# Altium project Motorsports Coaster.PrjPcb
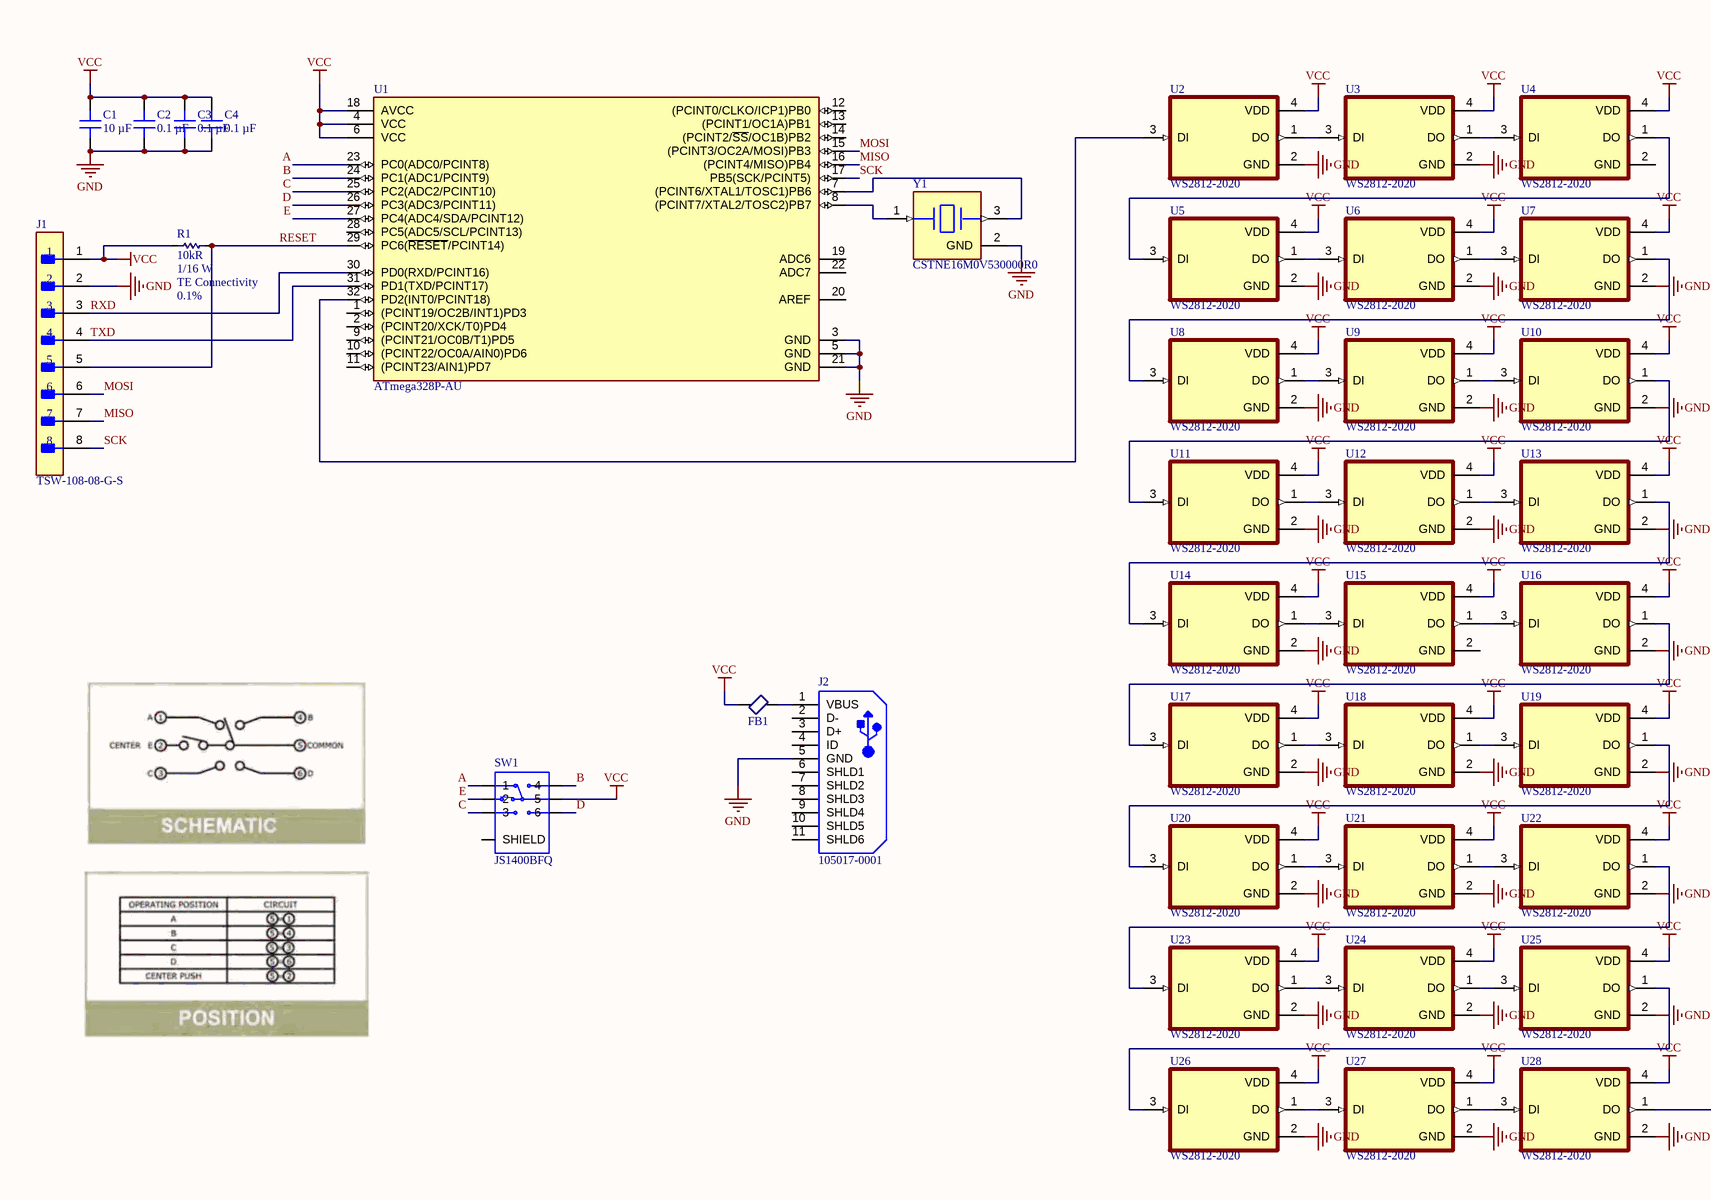
[diagram p0: Sheet4.SchDoc, left]
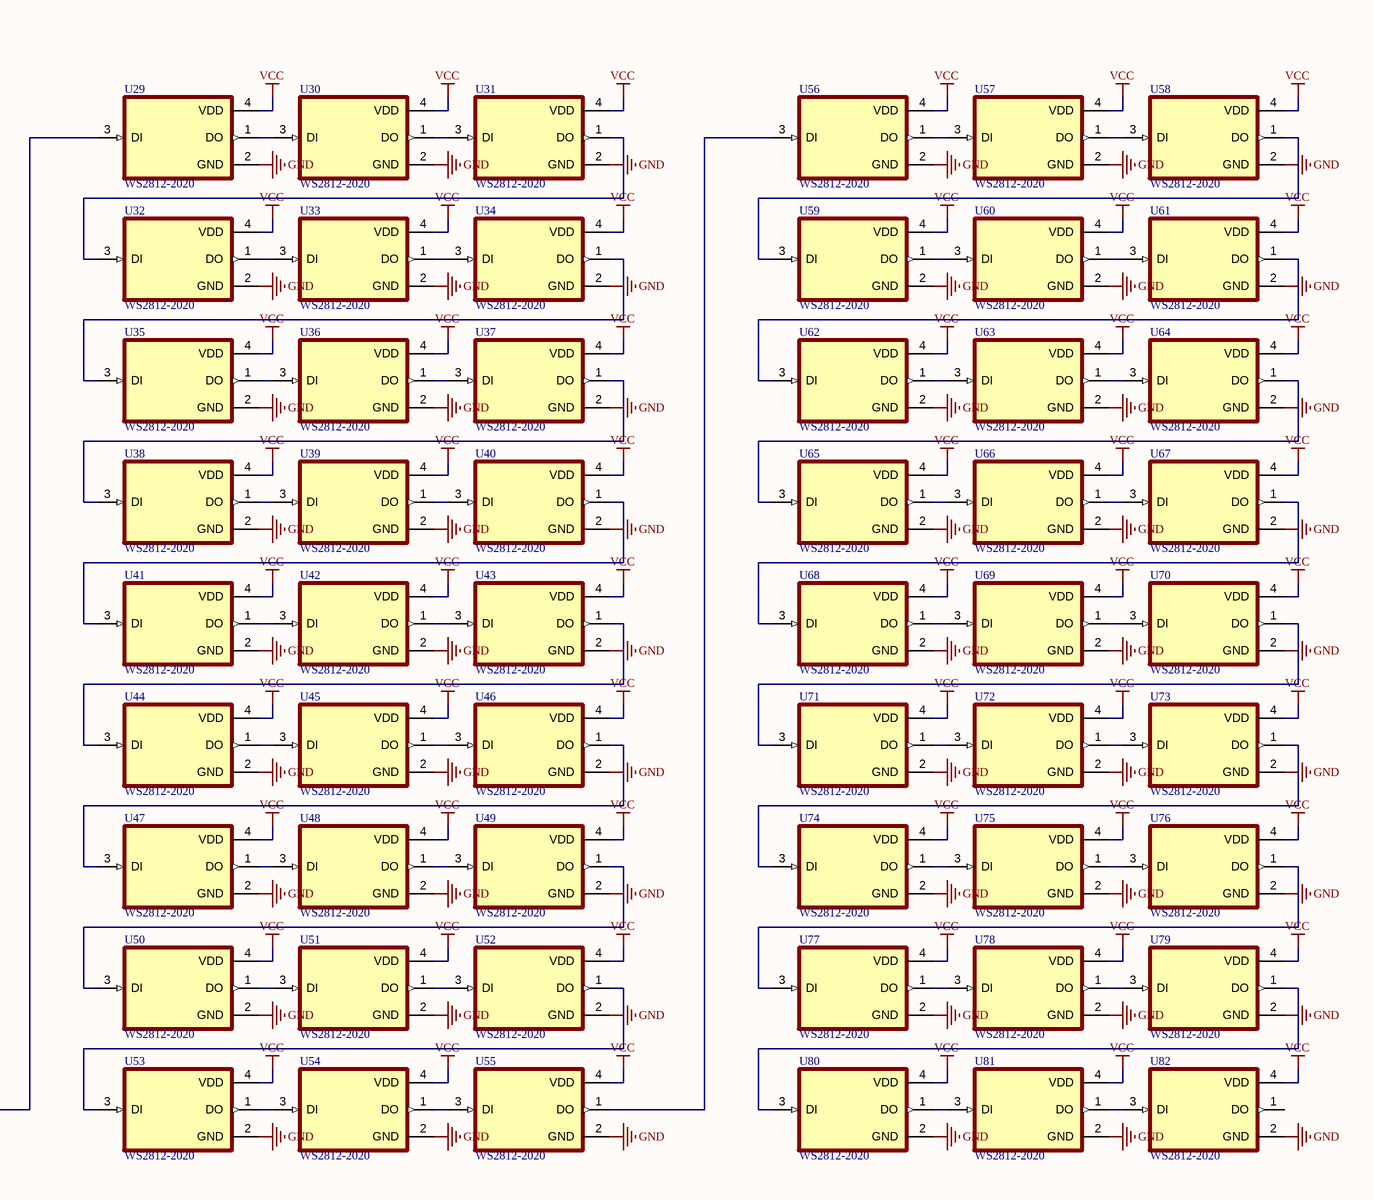
[diagram p1: Sheet4.SchDoc, right]
1 sheet, 92 parts. Net scope: global (net labels, ports and power ports of the same name join across sheets).
Board file: PCB2.PcbDoc

## Sheet Sheet4.SchDoc
size 863 x 558 mm; SheetDescription: Describe the sheet here.

### Parts
C1  10 µF  [CAP 0402_1005]
C2  0.1 µF  [CAP 0402_1005]
C3  0.1 µF  [CAP 0402_1005]
C4  0.1 µF  [CAP 0402_1005]
FB1  FB_330R_1.5A_0603  [FP-BLM18-0_15-t0_5-IPC_C]  (value not drawn)
J1  TSW-108-08-G-S  [FP-TSW-108-08-G-S-MFG]
J2  105017-0001  [USB-MICRO-B_V]
R1  Resistance: 10kR  Power: 1/16 W  Manufacturer: TE Connectivity  Tolerance: 0.1%  [FP-RN731E-IPC_B]  (hidden comment: RN73C1E10KBTG)
SW1  JS1400BFQ  [SW_JS1400BFQ]
U1  ATmega328P-AU  [FP-32A-MFG]
U2  WS2812-2020  [LED_WS2812-2020]
U3  WS2812-2020  [LED_WS2812-2020]
U4  WS2812-2020  [LED_WS2812-2020]
U5  WS2812-2020  [LED_WS2812-2020]
U6  WS2812-2020  [LED_WS2812-2020]
U7  WS2812-2020  [LED_WS2812-2020]
U8  WS2812-2020  [LED_WS2812-2020]
U9  WS2812-2020  [LED_WS2812-2020]
U10  WS2812-2020  [LED_WS2812-2020]
U11  WS2812-2020  [LED_WS2812-2020]
U12  WS2812-2020  [LED_WS2812-2020]
U13  WS2812-2020  [LED_WS2812-2020]
U14  WS2812-2020  [LED_WS2812-2020]
U15  WS2812-2020  [LED_WS2812-2020]
U16  WS2812-2020  [LED_WS2812-2020]
U17  WS2812-2020  [LED_WS2812-2020]
U18  WS2812-2020  [LED_WS2812-2020]
U19  WS2812-2020  [LED_WS2812-2020]
U20  WS2812-2020  [LED_WS2812-2020]
U21  WS2812-2020  [LED_WS2812-2020]
U22  WS2812-2020  [LED_WS2812-2020]
U23  WS2812-2020  [LED_WS2812-2020]
U24  WS2812-2020  [LED_WS2812-2020]
U25  WS2812-2020  [LED_WS2812-2020]
U26  WS2812-2020  [LED_WS2812-2020]
U27  WS2812-2020  [LED_WS2812-2020]
U28  WS2812-2020  [LED_WS2812-2020]
U29  WS2812-2020  [LED_WS2812-2020]
U30  WS2812-2020  [LED_WS2812-2020]
U31  WS2812-2020  [LED_WS2812-2020]
U32  WS2812-2020  [LED_WS2812-2020]
U33  WS2812-2020  [LED_WS2812-2020]
U34  WS2812-2020  [LED_WS2812-2020]
U35  WS2812-2020  [LED_WS2812-2020]
U36  WS2812-2020  [LED_WS2812-2020]
U37  WS2812-2020  [LED_WS2812-2020]
U38  WS2812-2020  [LED_WS2812-2020]
U39  WS2812-2020  [LED_WS2812-2020]
U40  WS2812-2020  [LED_WS2812-2020]
U41  WS2812-2020  [LED_WS2812-2020]
U42  WS2812-2020  [LED_WS2812-2020]
U43  WS2812-2020  [LED_WS2812-2020]
U44  WS2812-2020  [LED_WS2812-2020]
U45  WS2812-2020  [LED_WS2812-2020]
U46  WS2812-2020  [LED_WS2812-2020]
U47  WS2812-2020  [LED_WS2812-2020]
U48  WS2812-2020  [LED_WS2812-2020]
U49  WS2812-2020  [LED_WS2812-2020]
U50  WS2812-2020  [LED_WS2812-2020]
U51  WS2812-2020  [LED_WS2812-2020]
U52  WS2812-2020  [LED_WS2812-2020]
U53  WS2812-2020  [LED_WS2812-2020]
U54  WS2812-2020  [LED_WS2812-2020]
U55  WS2812-2020  [LED_WS2812-2020]
U56  WS2812-2020  [LED_WS2812-2020]
U57  WS2812-2020  [LED_WS2812-2020]
U58  WS2812-2020  [LED_WS2812-2020]
U59  WS2812-2020  [LED_WS2812-2020]
U60  WS2812-2020  [LED_WS2812-2020]
U61  WS2812-2020  [LED_WS2812-2020]
U62  WS2812-2020  [LED_WS2812-2020]
U63  WS2812-2020  [LED_WS2812-2020]
U64  WS2812-2020  [LED_WS2812-2020]
U65  WS2812-2020  [LED_WS2812-2020]
U66  WS2812-2020  [LED_WS2812-2020]
U67  WS2812-2020  [LED_WS2812-2020]
U68  WS2812-2020  [LED_WS2812-2020]
U69  WS2812-2020  [LED_WS2812-2020]
U70  WS2812-2020  [LED_WS2812-2020]
U71  WS2812-2020  [LED_WS2812-2020]
U72  WS2812-2020  [LED_WS2812-2020]
U73  WS2812-2020  [LED_WS2812-2020]
U74  WS2812-2020  [LED_WS2812-2020]
U75  WS2812-2020  [LED_WS2812-2020]
U76  WS2812-2020  [LED_WS2812-2020]
U77  WS2812-2020  [LED_WS2812-2020]
U78  WS2812-2020  [LED_WS2812-2020]
U79  WS2812-2020  [LED_WS2812-2020]
U80  WS2812-2020  [LED_WS2812-2020]
U81  WS2812-2020  [LED_WS2812-2020]
U82  WS2812-2020  [LED_WS2812-2020]
Y1  CSTNE16M0V530000R0  [FP-CSTNE16M0V530000R0-MFG]

### Nets
GND: C1.1 C2.1 C3.1 C4.1 J1.2 J2.5(GND) U1.3(GND) U1.5(GND) U1.21(GND) U2.2(GND) U3.2(GND) U5.2(GND) U6.2(GND) U7.2(GND) U8.2(GND) U9.2(GND) U10.2(GND) U11.2(GND) U12.2(GND) U13.2(GND) U14.2(GND) U16.2(GND) U17.2(GND) U18.2(GND) U19.2(GND) U20.2(GND) U21.2(GND) U22.2(GND) U23.2(GND) U24.2(GND) U25.2(GND) U26.2(GND) U27.2(GND) U28.2(GND) U29.2(GND) U30.2(GND) U31.2(GND) U32.2(GND) U33.2(GND) U34.2(GND) U35.2(GND) U36.2(GND) U37.2(GND) U38.2(GND) U39.2(GND) U40.2(GND) U41.2(GND) U42.2(GND) U43.2(GND) U44.2(GND) U45.2(GND) U46.2(GND) U47.2(GND) U48.2(GND) U49.2(GND) U50.2(GND) U51.2(GND) U52.2(GND) U53.2(GND) U54.2(GND) U55.2(GND) U56.2(GND) U57.2(GND) U58.2(GND) U59.2(GND) U60.2(GND) U61.2(GND) U62.2(GND) U63.2(GND) U64.2(GND) U65.2(GND) U66.2(GND) U67.2(GND) U68.2(GND) U69.2(GND) U70.2(GND) U71.2(GND) U72.2(GND) U73.2(GND) U74.2(GND) U75.2(GND) U76.2(GND) U77.2(GND) U78.2(GND) U79.2(GND) U80.2(GND) U81.2(GND) U82.2(GND) Y1.2(GND)
VCC: C1.2 C2.2 C3.2 C4.2 FB1.1 J1.1 R1.2 SW1.5 U1.4(VCC) U1.6(VCC) U1.18(AVCC) U2.4(VDD) U3.4(VDD) U4.4(VDD) U5.4(VDD) U6.4(VDD) U7.4(VDD) U8.4(VDD) U9.4(VDD) U10.4(VDD) U11.4(VDD) U12.4(VDD) U13.4(VDD) U14.4(VDD) U15.4(VDD) U16.4(VDD) U17.4(VDD) U18.4(VDD) U19.4(VDD) U20.4(VDD) U21.4(VDD) U22.4(VDD) U23.4(VDD) U24.4(VDD) U25.4(VDD) U26.4(VDD) U27.4(VDD) U28.4(VDD) U29.4(VDD) U30.4(VDD) U31.4(VDD) U32.4(VDD) U33.4(VDD) U34.4(VDD) U35.4(VDD) U36.4(VDD) U37.4(VDD) U38.4(VDD) U39.4(VDD) U40.4(VDD) U41.4(VDD) U42.4(VDD) U43.4(VDD) U44.4(VDD) U45.4(VDD) U46.4(VDD) U47.4(VDD) U48.4(VDD) U49.4(VDD) U50.4(VDD) U51.4(VDD) U52.4(VDD) U53.4(VDD) U54.4(VDD) U55.4(VDD) U56.4(VDD) U57.4(VDD) U58.4(VDD) U59.4(VDD) U60.4(VDD) U61.4(VDD) U62.4(VDD) U63.4(VDD) U64.4(VDD) U65.4(VDD) U66.4(VDD) U67.4(VDD) U68.4(VDD) U69.4(VDD) U70.4(VDD) U71.4(VDD) U72.4(VDD) U73.4(VDD) U74.4(VDD) U75.4(VDD) U76.4(VDD) U77.4(VDD) U78.4(VDD) U79.4(VDD) U80.4(VDD) U81.4(VDD) U82.4(VDD)
A: SW1.1 U1.23(PC0(ADC0/PCINT8))
B: SW1.4 U1.24(PC1(ADC1/PCINT9))
C: SW1.3 U1.25(PC2(ADC2/PCINT10))
D: SW1.6 U1.26(PC3(ADC3/PCINT11))
E: SW1.2 U1.27(PC4(ADC4/SDA/PCINT12))
MISO: J1.7 U1.16((PCINT4/MISO)PB4)
MOSI: J1.6 U1.15((PCINT3/OC2A/MOSI)PB3)
RESET: J1.5 R1.1 U1.29(PC6(~{RESET}/PCINT14))
RXD: J1.3 U1.30(PD0(RXD/PCINT16))
SCK: J1.8 U1.17(PB5(SCK/PCINT5))
TXD: J1.4 U1.31(PD1(TXD/PCINT17))
NetFB1_2: FB1.2 J2.1(VBUS)
NetSW1_SH1: SW1.SH1(SHIELD) SW1.SH2(SHIELD)
NetU1_7: U1.7((PCINT6/XTAL1/TOSC1)PB6) Y1.3(Output)
NetU1_8: U1.8((PCINT7/XTAL2/TOSC2)PB7) Y1.1(Input)
NetU1_32: U1.32(PD2(INT0/PCINT18)) U2.3(DI)
NetU2_1: U2.1(DO) U3.3(DI)
NetU3_1: U3.1(DO) U4.3(DI)
NetU4_1: U4.1(DO) U5.3(DI)
NetU5_1: U5.1(DO) U6.3(DI)
NetU6_1: U6.1(DO) U7.3(DI)
NetU7_1: U7.1(DO) U8.3(DI)
NetU8_1: U8.1(DO) U9.3(DI)
NetU9_1: U9.1(DO) U10.3(DI)
NetU10_1: U10.1(DO) U11.3(DI)
NetU11_1: U11.1(DO) U12.3(DI)
NetU12_1: U12.1(DO) U13.3(DI)
NetU13_1: U13.1(DO) U14.3(DI)
NetU14_1: U14.1(DO) U15.3(DI)
NetU15_1: U15.1(DO) U16.3(DI)
NetU16_1: U16.1(DO) U17.3(DI)
NetU17_1: U17.1(DO) U18.3(DI)
NetU18_1: U18.1(DO) U19.3(DI)
NetU19_1: U19.1(DO) U20.3(DI)
NetU20_1: U20.1(DO) U21.3(DI)
NetU21_1: U21.1(DO) U22.3(DI)
NetU22_1: U22.1(DO) U23.3(DI)
NetU23_1: U23.1(DO) U24.3(DI)
NetU24_1: U24.1(DO) U25.3(DI)
NetU25_1: U25.1(DO) U26.3(DI)
NetU26_1: U26.1(DO) U27.3(DI)
NetU27_1: U27.1(DO) U28.3(DI)
NetU28_1: U28.1(DO) U29.3(DI)
NetU29_1: U29.1(DO) U30.3(DI)
NetU30_1: U30.1(DO) U31.3(DI)
NetU31_1: U31.1(DO) U32.3(DI)
NetU32_1: U32.1(DO) U33.3(DI)
NetU33_1: U33.1(DO) U34.3(DI)
NetU34_1: U34.1(DO) U35.3(DI)
NetU35_1: U35.1(DO) U36.3(DI)
NetU36_1: U36.1(DO) U37.3(DI)
NetU37_1: U37.1(DO) U38.3(DI)
NetU38_1: U38.1(DO) U39.3(DI)
NetU39_1: U39.1(DO) U40.3(DI)
NetU40_1: U40.1(DO) U41.3(DI)
NetU41_1: U41.1(DO) U42.3(DI)
NetU42_1: U42.1(DO) U43.3(DI)
NetU43_1: U43.1(DO) U44.3(DI)
NetU44_1: U44.1(DO) U45.3(DI)
NetU45_1: U45.1(DO) U46.3(DI)
NetU46_1: U46.1(DO) U47.3(DI)
NetU47_1: U47.1(DO) U48.3(DI)
NetU48_1: U48.1(DO) U49.3(DI)
NetU49_1: U49.1(DO) U50.3(DI)
NetU50_1: U50.1(DO) U51.3(DI)
NetU51_1: U51.1(DO) U52.3(DI)
NetU52_1: U52.1(DO) U53.3(DI)
NetU53_1: U53.1(DO) U54.3(DI)
NetU54_1: U54.1(DO) U55.3(DI)
NetU55_1: U55.1(DO) U56.3(DI)
NetU56_1: U56.1(DO) U57.3(DI)
NetU57_1: U57.1(DO) U58.3(DI)
NetU58_1: U58.1(DO) U59.3(DI)
NetU59_1: U59.1(DO) U60.3(DI)
NetU60_1: U60.1(DO) U61.3(DI)
NetU61_1: U61.1(DO) U62.3(DI)
NetU62_1: U62.1(DO) U63.3(DI)
NetU63_1: U63.1(DO) U64.3(DI)
NetU64_1: U64.1(DO) U65.3(DI)
NetU65_1: U65.1(DO) U66.3(DI)
NetU66_1: U66.1(DO) U67.3(DI)
NetU67_1: U67.1(DO) U68.3(DI)
NetU68_1: U68.1(DO) U69.3(DI)
NetU69_1: U69.1(DO) U70.3(DI)
NetU70_1: U70.1(DO) U71.3(DI)
NetU71_1: U71.1(DO) U72.3(DI)
NetU72_1: U72.1(DO) U73.3(DI)
NetU73_1: U73.1(DO) U74.3(DI)
NetU74_1: U74.1(DO) U75.3(DI)
NetU75_1: U75.1(DO) U76.3(DI)
NetU76_1: U76.1(DO) U77.3(DI)
NetU77_1: U77.1(DO) U78.3(DI)
NetU78_1: U78.1(DO) U79.3(DI)
NetU79_1: U79.1(DO) U80.3(DI)
NetU80_1: U80.1(DO) U81.3(DI)
NetU81_1: U81.1(DO) U82.3(DI)

Not connected (* = marked no-connect by the designer): J2 2(D-) 3(D+) 4(ID) 6(SHLD1) 7(SHLD2) 8(SHLD3) 9(SHLD4) 10(SHLD5) 11(SHLD6); U1 1((PCINT19/OC2B/INT1)PD3) 2((PCINT20/XCK/T0)PD4) 9((PCINT21/OC0B/T1)PD5) 10((PCINT22/OC0A/AIN0)PD6) 11((PCINT23/AIN1)PD7) 12((PCINT0/CLKO/ICP1)PB0) 13((PCINT1/OC1A)PB1) 14((PCINT2/~{SS}/OC1B)PB2) 19(ADC6) 20(AREF) 22(ADC7) 28(PC5(ADC5/SCL/PCINT13)); U4 2(GND); U15 2(GND); U82 1(DO)

### Notes on the sheet
- DWG. NO.
- REV.
- SHT.
- REVISION
- DESCRIPTION
- DATE
- APPROVED
- THIS DOCUMENT AND THE DATA DISCLOSED HEREIN OR HEREWITH IS THE PROPERTY OF ALTIUM LIMITED AND MAY BE FREELY DISTRIBUTED IN WHOLE. NO RIGHTS ARE RESERVED OR EXPRESS OR IMPLIED WARANTEE GIVEN.
- ENG:
- DSN:
- APPROVALS
- PROJECT
- DOCUMENT REVISION:
- DESIGN ITEM:
- CHK:
- BOM:
- REFERENCE DOCUMENTS
- PROJECT REVISION:
- TITLE
- FAB DWG:
- PCB DWG:
- ASSY DWG:
- SCALE:
- SIZE
- D
- CAGE CODE
- FILE NAME
- DWG NO.
- SHEET
- OF
- REV

### Library data of the parts
C1 = CL05A106MP5NUNC: CAP CER 10UF 10V X5R 0402; manufacturer: Samsung Electro-Mechanics; Tolerance: ±20%; Part Number: CL05A106MP5NUNC; Value: 10 µF; Applications: General Purpose; Capacitance: 10 µF; componentlink1description: Datasheet; componentlink1url: http://www.samsungsem.com/kr/support/product-search/mlcc/CL05A106MP5NUNC.jsp; componentlink2description: DigiKey Link; componentlink2url: https://www.digikey.com/en/products/detail/samsung-electro-mechanics/CL05A106MP5NUNC/3887108; Device Package: 0402 (1005 Metric); lastupdated: 9/19/2022 12:57:35 PM; Lifecycle Status: Active; Minimum Order: 1; Mounting Type: Surface Mount, MLCC; Operating Temperature: -55°C ~ 85°C; Package / Case: 0402 (1005 Metric); packaging: TapeAndReel; partid: 1762; Part Status: Active; price: 0.02; series: CL; Size / Dimension: 0.039" L x 0.020" W (1.00mm x 0.50mm); Supplier 1: DigiKey; Supplier Part Number 1: 1276-1450-1-ND; Temperature Coefficient: X5R; Thickness (Max): 0.028" (0.70mm); Voltage - Rated: 10V
C2-C4 = CL05A104KP5NNNC: CAP CER 0.1UF 10V X5R 0402; manufacturer: Samsung Electro-Mechanics; Tolerance: ±10%; Part Number: CL05A104KP5NNNC; Value: 0.1 µF; Applications: General Purpose; Capacitance: 0.1 µF; componentlink1description: Datasheet; componentlink1url: http://www.samsungsem.com/kr/support/product-search/mlcc/CL05A104KP5NNNC.jsp; componentlink2description: DigiKey Link; componentlink2url: https://www.digikey.com/en/products/detail/samsung-electro-mechanics/CL05A104KP5NNNC/3886680; Device Package: 0402 (1005 Metric); lastupdated: 9/19/2022 12:57:22 PM; Lifecycle Status: Active; Minimum Order: 1; Mounting Type: Surface Mount, MLCC; Operating Temperature: -55°C ~ 85°C; Package / Case: 0402 (1005 Metric); packaging: CutTape; partid: 6074; Part Status: Active; price: 0.01; series: CL; Size / Dimension: 0.039" L x 0.020" W (1.00mm x 0.50mm); Supplier 1: DigiKey; Supplier Part Number 1: 1276-1022-1-ND; Temperature Coefficient: X5R; Thickness (Max): 0.022" (0.55mm); Voltage - Rated: 10V
FB1 = CMP-006-00025-1: Ferrite Beads Multi-Layer 330Ohm 25% 100MHz 1.5A 70mOhm DCR 0603 Paper T/R
J1 = CMP-02766-000001-1: CONN HEADER VERT 8POS 2.54MM; Manufacturer: Samtec; Number Of Contacts: 8; Conn Orientation: Straight; Conn Gender: Male; Device Class L1: Connectors; ComponentLink2Description: Datasheet; Digikey Description: CONN HEADER VERT 8POS 2.54MM; ComponentLink2URL: http://suddendocs.samtec.com/catalog_english/tsw_th.pdf; Temperature: -55°C to +125°C; RoHS: TRUE; Mouser Description: TSW - Samtec 2.54mm Pin Header 13.46mm Overall Pin Length 5.08mm Tail; Automotive: No; Temperature Range High: +125°C; Package: TSW-108-08-G-S; Device Class L3: unset; Manufacturer Part Number: TSW-108-08-G-S; Pitch: 2.54mm; Number Of Rows: 1; Lead Free: Yes; Height: 8.71mm; Contact Material: Gold,Nickel; Footprint Url: http://suddendocs.samtec.com/prints/tsw-xxx-xx-x-x-xx-xxx-footprint.pdf; Temperature Range Low: -55°C; Octopart: https://octopart.com/tsw-108-08-g-s-samtec-272653; Category: Conn; Device Class L2: Headers and Wire Housings
J2 = CMP-2000-05827-1: Micro-USB B Receptacle, Right Angle, Bottom Mount, Surface Mount, with Solder Tabs, -30 to 85 degC, 5-Pin USB, RoHS, Tape and Reel; Manufacturer: Molex; Featured Product: Micro-USBConnectorsUSBConnectors; Other Names: WM1399DKR; Package Version: Rev. F, 12/2012; Number of Contacts: 5; Connector Type: USB-microB; Catalog Drawings: 1050170001; 3D Model: 105017-0001.stp; Mating Products: WM17145-ND-CABLEMICROUSBBTOSTDA1.0MWM17147-ND-CABLEMICROUSBBTOSTDA2.0MWM17146-ND-CABLEMICROUSBBTOSTDA1.5M; PCN Assembly/Origin: ResinSupplier21/Oct/2015; Voltage - Max: 30V; Online Catalog: Molex-MicroUSB; Manufacturer URL: http://www.molex.com/; Package Description: 5-Leads USB, Micro B, Body 7.5 x 5 mm, Pitch 0.65 mm; Datasheet URL: http://www.molex.com/elqNow/elqRedir.htm?ref=http://www.molex.com/webdocs/datasheets/pdf/en-us/1050170001_IO_CONNECTORS.pdf; Ingress Protection: -; Datasheet Version: 03/2016; Mounting Type: BoardCutout,SurfaceMount,RightAngle; Circuits: 5; Standard Package: 1; Package Reference: MICRO-B; Package URL: http://www.molex.com/pdm_docs/sd/1050170001_sd.pdf; Category: Connectors,Interconnects; Series: -; RoHS Information: 1050170001CertofCompliance; Features: Shielded,SolderRetention; Family: USB,DVI,HDMIConnectors; Specifications: -; Gender: Receptacle; Packaging: Digi-Reel®; Mounting Technology: SurfaceMount
R1 = CMP-009-00183-1: RES 10K 0402 1/16W, RN73C1E10KBTG; PartNumber: RN73C1J4R99BTD; OpTempRange: -55C ~ +155C; Rating: 50V; ComponentLink1URL: https://www.te.com/commerce/DocumentDelivery/DDEController?Action=srchrtrv&DocNm=1773270&DocType=DS&DocLang=English; Type: SMD; Pin Count: 2; Source: GoodResistor.SchLib; ComponentLink1Description: Datasheet; Component Type: Standard; Design Item ID: CMP-001-0001-7; Qualification: N/A; Package: 0402
SW1 = CMP-049-000000-2: Navigation Switch, 2 - Axis Digital (Mechanical Switch) Output; MF: E-Switch; Digi-Key_Part_Number: EG5858-ND; Pin Count: 8; Design Item ID: JS1400BFQ; SnapEDA_Link: https://www.snapeda.com/parts/JS1400BFQ/E-Switch/view-part/2768291/?ref=snap; Source: SnapEDAsch.SchLib; Value: *; MP: JS1400BFQ; Component Type: Standard; Package: None
U1 = CMP-06276-000013-1: IC MCU 8BIT 32KB FLASH 32TQFP; Manufacturer: Microchip; Nominal Supply Current: 0.04-5.2mA; Number Of Timers/Counters: 3; Number Of Adc Channels: 8; Number Of I2C Channels: 1; Min Supply Voltage: 1.8V; Standoff Height: 0.05mm; Data Bus Width: 8bits; Ram Size: 2KBytes; Max Supply Voltage: 5.5V; Interface: I2C,SPI,UART,USART,2-Wire; Frequency: 20MHz; Number Of Pwm Channels: 6; Memory Size: 32KBytes; Number Of I/Os: 23; Core Architecture: AVR; Temperature: -40°C to +85°C; Number Of Spi Channels: 1; Digikey Description: IC MCU 8BIT 32KB FLASH 32TQFP; Category: IC; RoHS: TRUE; Memory Type: FLASH; Package: 32A; ComponentLink2Description: Datasheet; Number Of Uart Channels: 1; Temperature Range High: +85°C; Octopart: https://octopart.com/atmega328p-au-microchip-77760215; Footprint Url: http://ww1.microchip.com/downloads/en/appnotes/atmel-8826-seeprom-pcb-mounting-guidelines-surface-mount-packages-applicationnote.pdf; Lead Free: Yes; Device Class L1: Integrated Circuits (ICs); Device Class L2: Embedded Processors and Controllers; Ipc Land Pattern Name: QFP80P900X900X120-32; Number Of A/D Converters: 1; Number Of Cores: 1; Automotive: No; Temperature Range Low: -40°C; Mouser Description: ATmega Series 32 KB Flash 2 KB SRAM 20 MHz 8-Bit Microcontroller - TQFP-32; ComponentLink2URL: http://ww1.microchip.com/downloads/en/DeviceDoc/ATmega48A-PA-88A-PA-168A-PA-328-P-DS-DS40002061A.pdf; Height: 1.2mm; Manufacturer Part Number: ATmega328P-AU; Device Class L3: Microcontrollers
U2-U82 = CMP-045-000000-2: Intelligent control LED integrated light source, WS2812-2020; MP: WS2812-2020; Price: None; Pin Count: 4; Value: *; Component Type: Standard; Availability: Unavailable; Design Item ID: WS2812-2020; Package: None; Source: WS2812-2020.SchLib
Y1 = CMP-06054-000001-1: CERAMIC RES 16.0000MHZ 15PF SMD; Manufacturer: Murata; Tolerance: 0.5%; Stability: 0.3%; Description: 16MHz Ceramic Resonator Built in Capacitor 15pF ±0.3% 40 Ohms -40°C ~ 85°C Surface Mount; Frequency: 16MHz; Esr: 40Ω; Lead Free: Yes; ComponentLink2URL: https://www.murata.com/en-sg/products/productdata/8801162231838/SPEC-CSTNE16M0V530000R0.pdf?1545967809000; ComponentLink2Description: Datasheet; Device Class L3: Crystals; Load Capacitance: 15pF; Temperature: -40°C to +85°C; Temperature Range High: +85°C; Series: CSTNE_V; Mouser Description: Ceramic Resonator 16MHz ±0.5% (Tol) ±0.3% (Stability) 15pF 40Ohm 3-Pin CSMD T/R; Automotive: No; RoHS: TRUE; Device Class L2: Crystals / Oscillators; Manufacturer Part Number: CSTNE16M0V530000R0; Package: 0; Category: Crys; Device Class L1: Passive Components; Height: 1mm; Temperature Range Low: -40°C; Digikey Description: CERAMIC RES 16.0000MHZ 15PF SMD; Octopart: https://octopart.com/cstne16m0v530000r0-murata-91406924